# Altium schematic sheet Power_Protection.SchDoc: Power Protection
size Letter; DrawnBy: Nathan Petersen; Engineer: Nathan Petersen; Organization: Altium Limited; Address1: L3, 12a Rodborough Rd; Address2: Frenchs Forest; Address3: NSW; Address4: Australia 2086; DocumentNumber: 4; Revision: v1.2; SheetNumber: 4; SheetTotal: 23
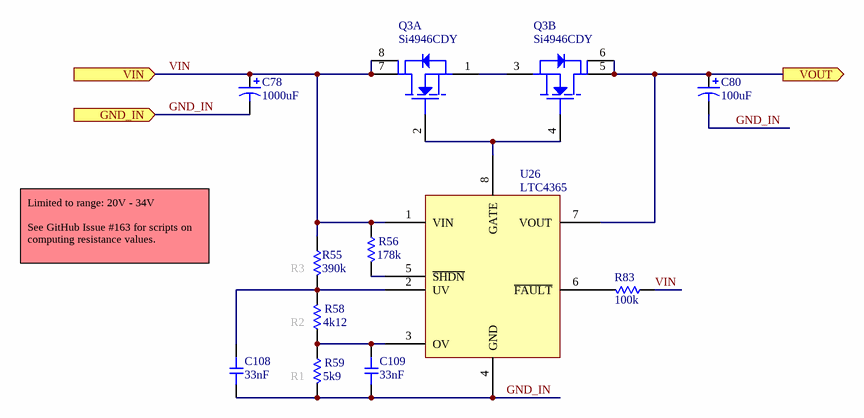
[diagram p0: Power_Protection.SchDoc]

## Parts
C78  value 1000uF  [CAP - UVR1H102MHD1TO]  (hidden comment: Cap Pol1)
C80  value 100uF  [CAP - UWT1V101MCL1GS]  (hidden comment: Cap Pol1)
C108  value 33nF  [0603-CAP]  (hidden comment: Capacitor)
C109  value 33nF  [0603-CAP]  (hidden comment: Capacitor)
Q3  Si4946CDY  [SOIC127P600X175-8N]  (parts A,B of 2)
R55  value 390k  [0603-RES]  (hidden comment: Resistor)
R56  value 178k  [0603-RES]  (hidden comment: Resistor)
R58  value 4k12  [0603-RES]  (hidden comment: Resistor)
R59  value 5k9  [0603-RES]  (hidden comment: Resistor)
R83  value 100k  [0603-RES]  (hidden comment: Resistor)
U26  LTC4365  [TSOP65P280X100-8N]

## Ports
GND_IN (in), VIN (in), VOUT (out)

## Nets
GND_IN: C78.2 C80.2 C108.2 C109.2 R59.2 U26.4(GND) ; port GND_IN
VIN: C78.1 Q3.7(D1) Q3.8(D1) R55.1 R56.1 R83.1 U26.1(VIN) ; port VIN
VOUT: C80.1 Q3.5(D2) Q3.6(D2) U26.7(VOUT) ; port VOUT
NetC108_1: C108.1 R55.2 R58.2 U26.2(UV)
NetC109_1: C109.1 R58.1 R59.1 U26.3(OV)
NetQ3_1: Q3.1(S1) Q3.3(S2)
NetQ3_2: Q3.2(G1) Q3.4(G2) U26.8(GATE)
NetR56_2: R56.2 U26.5(~{SHDN})
NetR83_2: R83.2 U26.6(~{FAULT})

## Notes on the sheet
- Limited to range: 20V - 34V
  See GitHub Issue #163 for scripts on computing resistance values.
- (near R55) R3
- (near R58) R2
- (near R59) R1
- Title:
- File:
- Sheet:
- of
- Revision:
- Time:
- Date:
- Engineer:

## Library data of the parts
C78 C80 = Cap Pol1: Polarized Capacitor (Radial); Supplier 1: Digi-Key
  C78: Supplier Part Number 1: 493-12786-1-ND
  C80: Supplier Part Number 1: 493-2203-6-ND
Q3 = SI4946CDY-T1-GE3: MOSFET N-CHAN DUAL 60V SO-8; Supplier 1: Digi-Key; Supplier Part Number 1: SI4946CDY-T1-GE3DKR-ND
U26 = LTC4365CTS8#TRMPBF: IC OVERVOLTAGE PROT TSOT23-8; Supplier 1: Digi-Key; Supplier Part Number 1: LTC4365CTS8#TRMPBFCT-ND
C108 C109 = Capacitor: Supplier 1: Digi-Key; Supplier Part Number 1: 1276-2041-1-ND
R55 R56 R58 R59 R83 = Resistor: Supplier 1: Digi-Key
  R55: Supplier Part Number 1: 311-390KHRCT-ND
  R56: Supplier Part Number 1: 311-178KHRCT-ND
  R58: Supplier Part Number 1: 311-4.12KHRCT-ND
  R59: Supplier Part Number 1: 311-5.90KHRCT-ND
  R83: Supplier Part Number 1: 311-100KLDCT-ND